# Altium project 220V to 48v SMPS.PrjPcb
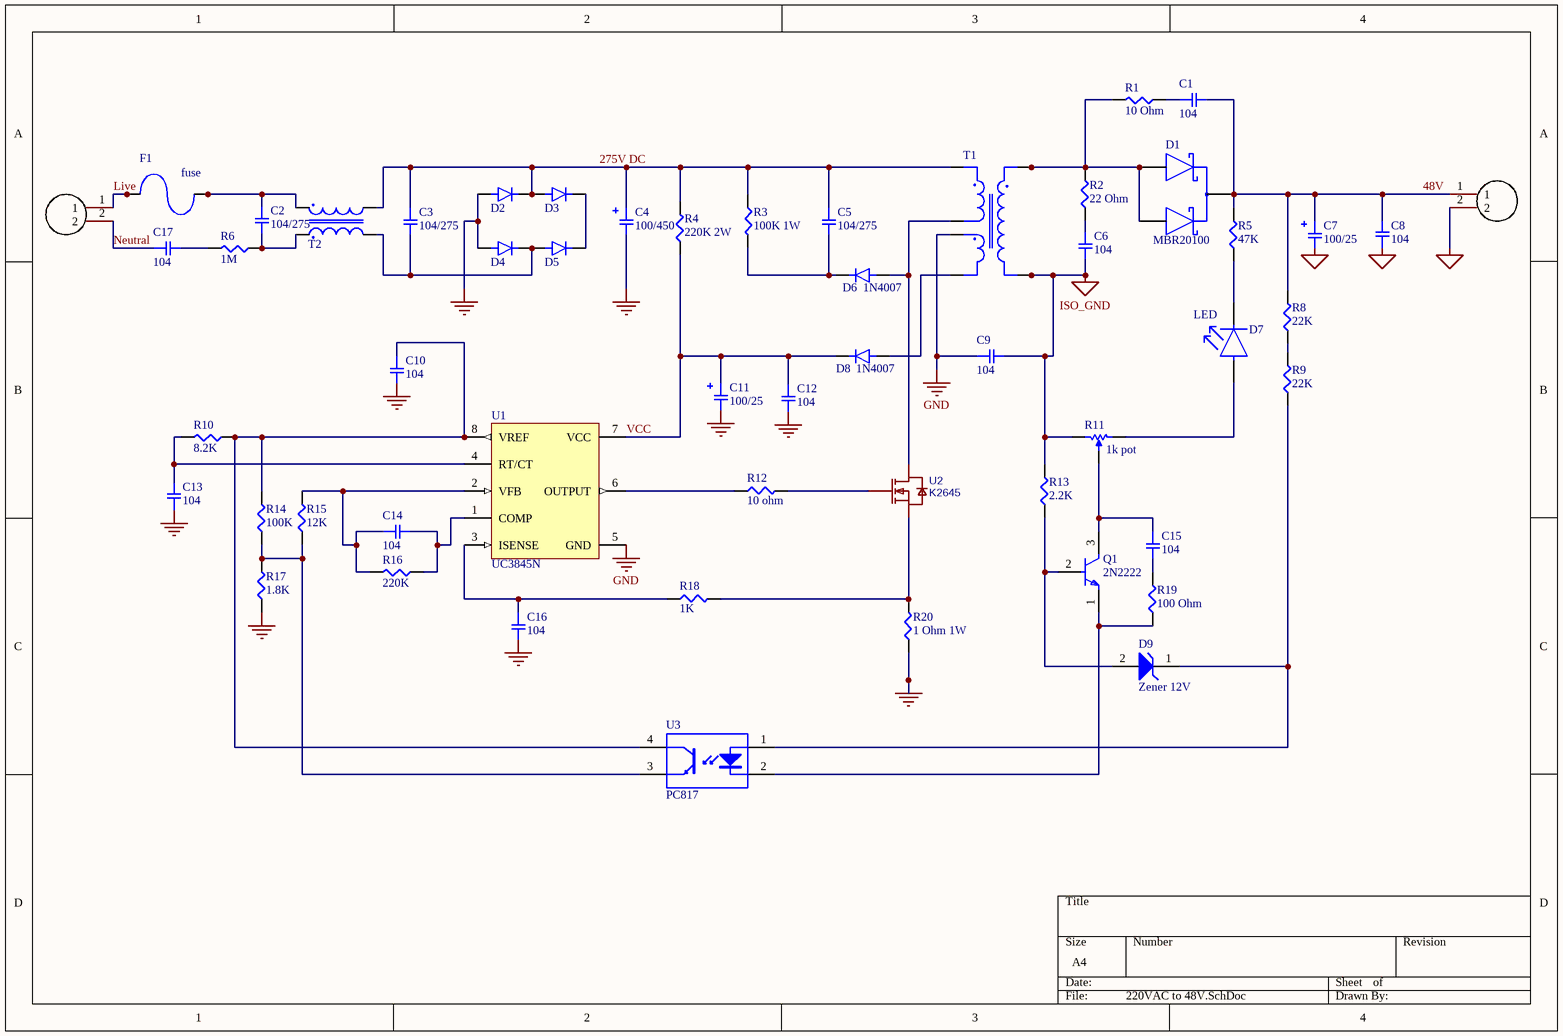
[diagram p0: 220VAC to 48V.SchDoc]
1 sheet, 54 parts. Net scope: global (net labels, ports and power ports of the same name join across sheets).
Board file: 220VAC to 48V.PcbDoc

## Sheet 220VAC to 48V.SchDoc
size A4; SheetNumber: 1; SheetTotal: 1

### Parts
C1  104  [C-1]
C2  104/275  [C-15]
C3  104/275  [C-15]
C4  100/450  [C5B2.5]
C5  104/275  [C-15]
C6  104  [C-1]
C7  100/25  [C2.5-2]
C8  104  [C-1]
C9  104  [C-1]
C10  104  [C-1]
C11  100/25  [C2.5-2]
C12  104  [C-1]
C13  104  [C-1]
C14  104  [C-1]
C15  104  [C-1]
C16  104  [C-1]
C17  104  [C-1]
CN1  WJ2EDGRC-5.08-2P  [Terminal Block P5.08-2P]  (value not drawn)
CN2  WJ2EDGRC-5.08-2P  [Terminal Block P5.08-2P]  (value not drawn)
D1  MBR20100  [FP-MBR20100CT-E3-4W-MFG]
D2  1N4007  [FP-1N4007-MFG]  (value not drawn)
D3  1N4007  [FP-1N4007-MFG]  (value not drawn)
D4  1N4007  [FP-1N4007-MFG]  (value not drawn)
D5  1N4007  [FP-1N4007-MFG]  (value not drawn)
D6  1N4007  [FP-1N4007-MFG]
D7  LED  [FP-HLMP-1719-MFG]
D8  1N4007  [FP-1N4007-MFG]
D9  Zener 12V  [ONSC-SURMETIC40-2-017AA-01]
F1  fuse  [SHK20L]
Q1  2N2222  [FP-JAN2N2222A-MFG]
R1  10 Ohm  [R7-5]
R2  22 Ohm  [R7-5]
R3  100K 1W  [R-12,5]
R4  220K 2W  [R-12,5]
R5  47K  [R7-5]
R6  1M  [R7-5]
R8  22K  [R7-5]
R9  22K  [R7-5]
R10  8.2K  [R7-5]
R11  1k pot  [BOUR-3296W-1-3]
R12  10 ohm  [R7-5]
R13  2.2K  [R7-5]
R14  100K  [R7-5]
R15  12K  [R7-5]
R16  220K  [R7-5]
R17  1.8K  [R7-5]
R18  1K  [R7-5]
R19  100 Ohm  [R7-5]
R20  1 Ohm 1W  [R-12,5]
T1  Ideal Transformer With Central Tap  [ST-D1]  (value not drawn)
T2  common mode choke  [DFKH14]  (value not drawn)
U1  UC3845N  [P0008A]
U2  K2645  [TO-220-3_L10.5-W4.8-P2.54-L]
U3  PC817  [LTST-LTV-817-4]

### Nets
GND: C4.2 C9.1 C10.2 C11.2 C12.2 C13.1 C16.2 D2.2(A) D4.2(A) R17.1 R20.1 T1.8 U1.5(GND)
ISO_GND: C6.2 C7.2 C8.1 C9.2 CN1.2 R11.3(B) R13.2 T1.1 T1.2
48V: C1.2 C7.1 C8.2 CN1.1 D1.2(COMMON_CATHODE) R5.2 R8.2
275V DC: C3.1 C4.1 C5.1 D2.1(C) D3.2(A) R3.1 R4.2 T1.7 T2.3
Live: CN2.1 F1.1A F1.1B
Neutral: C17.1 CN2.2
VCC: C11.1 C12.1 D8.1(C) R4.1 U1.7(VCC)
NetC1_1: C1.1 R1.1
NetC2_1: C2.1 F1.2A F1.2B T2.4
NetC2_2: C2.2 R6.1 T2.1
NetC3_2: C3.2 D4.1(C) D5.2(A) T2.2
NetC5_2: C5.2 D6.1(C) R3.2
NetC6_1: C6.1 R2.1
NetC10_1: C10.1 R10.1 R14.2 U1.8(VREF) U3.4(COLLECTOR)
NetC13_2: C13.2 R10.2 U1.4(RT/CT)
NetC14_1: C14.1 R15.2 R16.2 U1.2(VFB)
NetC14_2: C14.2 R16.1 U1.1(COMP)
NetC15_1: C15.1 Q1.3(C) R11.2(TAP)
NetC15_2: C15.2 R19.2
NetC16_1: C16.1 R18.1 U1.3(ISENSE)
NetC17_2: C17.2 R6.2
NetD1_1: D1.1(1_ANODE) D1.3(2_ANODE) R1.2 R2.2 T1.5 T1.6
NetD3_1: D3.1(C) D5.1(C)
NetD6_2: D6.2(A) T1.9 U2.2(D)
NetD7_1: D7.1(C) R5.1
NetD7_2: D7.2(A) R11.1(A)
NetD8_2: D8.2(A) T1.12
NetD9_1: D9.1(K) R9.1 U3.1(ANODE)
NetD9_2: D9.2(A) Q1.2(B) R13.1
NetQ1_1: Q1.1(E) R19.1 U3.2(CATHODE)
NetR8_1: R8.1 R9.2
NetR12_1: R12.1 U1.6(OUTPUT)
NetR12_2: R12.2 U2.1(G)
NetR14_1: R14.1 R15.1 R17.2 U3.3(EMITTER)
NetR18_2: R18.2 R20.2 U2.3(S)

### Library data of the parts
C1 C6 C8-C10 C12-C17 = CAPACITOR 104
C2 C3 C5 = CAPACITOR 104/275
C4 = CAPACITOR 100/450
C7 C11 = CAPACITOR 100/25
CN1 CN2 = WJ2EDGRC-5.08-2P: Manufacturer: KANGNEX(康奈克斯电气); Add into BOM: yes; Connector Type: 板端/Receptacle-Close; Structure: 1x2P; Pitch: 5.08mm; Number of PINs Per Row: 2; Symbol: WJ2EDGRC-5.08-2P; Device: WJ2EDGRC-5.08-2P; Supplier: LCSC; Manufacturer Part: WJ2EDGRC-5.08-2P; Supplier Part: C3697; JLCPCB Part Class: Extended Part; LCSC Part Name: 5.08mm 1x2P 排数:1 每排P数:2; Supplier Footprint: 弯插,P=5.08mm; Datasheet: https://atta.szlcsc.com/upload/public/pdf/source/20191225/C3697_6E7B45CD3FD3DA2CDF6A2CE707235E10.pdf; Convert to PCB: yes; Color: Green; Mounting Style: Bend; Number of Pins: 2P; Number of Rows: 1
D1 = CMP-00030-42878425-1: MBR20100CT-E3/4W Dual Common-Cathode High-Voltage Schottky Rectifier | DIODE ARRAY SCHOTTKY 100V TO220; Forward Voltage: 800mV; Max Junction Temperature (Tj): 150°C; Forward Current: 20A; Max Surge Current: 150A; Max Reverse Leakage Current: 100µA; Average Rectified Current: 10A; Element Configuration: Common Cathode; Length: 10.5156mm; Schedule B: 8541100080, 8541100080|8541100080, 8541100080|8541100080|8541100080, 8541100080|8541100080|8541100080|8541100080; Case/Package: TO-220AB; Max Reverse Voltage (DC): 100V; NexarPartId: 42878425; Number of Pins: 3; Min Operating Temperature: -65°C; Reverse Voltage: 100V; Height: 15.3162mm; Peak Non-Repetitive Surge Current: 150A; RoHS: Compliant; Max Operating Temperature: 150°C; Radiation Hardening: No; Lead Free: Lead Free; Mount: Through Hole; Max Repetitive Reverse Voltage (Vrrm): 100V; Max Forward Surge Current (Ifsm): 150A; Width: 4.699mm; Peak Reverse Current: 100µA
D2-D6 D8 = CMP-02540-000046-1: DIODE GEN PURP 1KV 1A DO204AL; Manufacturer: Vishay; Manufacturer Part Number: 1N4007-E3/54; Value: 15pF; Max Junction Temp: +150°C; Max Surge Forward Current: 30A; Max Repetitive Reverse Voltage: 1000V; Peak Reverse Current: 30uA; Octopart: https://octopart.com/1n4007-e3%2F54-vishay-39548207; Digikey Description: DIODE GEN PURP 1KV 1A DO204AL; Category: Diode; Mouser Description: Rectifiers Vr/1000V Io/1A; Automotive: No; Package: 1N4007; Device Class L3: Rectifier Diodes; Temperature Range High: +150°C; Capacitance: 15pF; Ipc Land Pattern Name: DIOPA1088W105L520D270; Lead Free: Yes; ComponentLink2Description: Datasheet; Forward Current: 1A; Device Class L1: Discrete Semiconductors; ComponentLink2URL: http://www.vishay.com/docs/88503/1n4001.pdf; Temperature Range Low: -50°C; Height: 2.7mm; RoHS: TRUE; Temperature: -50°C to +150°C; Device Class L2: Diodes
D7 = CMP-2000-06410-2: IR LED SFH480; Manufacturer: Broadcom; Wavelength: 880nm; Led Orientation: Straight; Luminous Intensity: 2.1mcd; Forward Voltage: 1.8V; Viewing Angle: 50°; Colour: Yellow; Reverse Voltage: 5V; Power Dissipation: 17.5mW; Forward Current: 2mA; Lead Free: Yes; Automotive: No; Device Class L1: Optoelectronics; Mouser Description: Standard LEDs - Through Hole Yellow Diffused 585nm 2.1mcd; Digikey Description: LED YELLOW DIFFUSED T-1 T/H; Temperature: -40°C to +100°C; Temperature Range High: +100°C; Package: 0; Category: Diode; Device Class L2: LEDs; ComponentLink2Description: Datasheet; ComponentLink2URL: https://docs.broadcom.com/docs/AV02-1557EN; Temperature Range Low: -40°C; Device Class L3: unset; Octopart: https://octopart.com/hlmp-1719-broadcom-71130405; RoHS: TRUE; Manufacturer Part Number: HLMP-1719
D9 = 1N4742A-TR: Diode, Zener, Vr 12V, If 200mA, Pkg DO-41, Vf 1.2V, Tj +175C, Cs 380mA, Pd 1.3W, Ir 21mA; Manufacturer: Vishay; Tolerance: 5%; Impedance: 9R; Max Reverse Leakage Current: 5uA; Supplier: Digikey; Supplier Part Number: 1N4742AVSCT-ND; Manufacturer Part Number: 1N4742A-TR; RoHS: Yes; Category: Zener Diodes; Stock: 55025; Pricing: 1=0.36, 10=0.251, 100=0.1267, 500=0.10332, 1000=0.07666, 2000=0.0645 (USD); Mounting Technology: Through Hole; Case/Package: DO-41; Pins: 2; Min Operating Temperature: -65°C; Max Operating Temperature: 175°C; Packaging: Cut Tape; Zener Voltage: 12V; Power Dissipation: 1.3W; Max Power Dissipation: 1.3W; Test Current: 21mA; Voltage Tolerance: 5%; Series: Automotive, AEC-Q101; Forward Voltage: 1.2V; Working Voltage: 12V; Max Reverse Current: 5uA; Breakdown Voltage: 12V; Diameter: 2.6mm; Length: 0.161inch; Width: 2.6mm; Height: 2.6mm; Radiation Hardening: No; Lead Free: Lead Free; RoHS Compliant: Yes; Reach SVHC Compliant: Unknown; ComponentLink1URL: https://datasheet.ciiva.com/27050/813394-27050166.pdf?src-supplier=Jameco; ComponentLink1Description: https://datasheet.ciiva.com/27050/813394-27050166.pdf?src-supplier=Jameco; ComponentLink2URL: https://datasheet.ciiva.com/18434/70061602-18434087.pdf?src-supplier=Allied+Electronics; ComponentLink2Description: https://datasheet.ciiva.com/18434/70061602-18434087.pdf?src-supplier=Allied+Electronics; ComponentLink3URL: https://datasheet.ciiva.com/26320/1n4728a-26320207.pdf?src-supplier=Element14; ComponentLink3Description: https://datasheet.ciiva.com/26320/1n4728a-26320207.pdf?src-supplier=Element14
Q1 = CMP-06366-000013-1: TRANS NPN 50V 0.8A TO218
R1 R2 R5 R6 R8-R10 R12-R19 = RESISTOR 1/4W
R3 R4 R20 = RESISTOR 2W
R11 = CMP-1747-00002-1: Square Trimpot(R) Trimming Potentiometer, 1000 Ohm, -55 to 125 degC, 3-Pin THD, RoHS, Tube; Case\Package: 0603; Tolerance: 1%; Power Rating: 100 mW; Voltage Rating: 75 V; Resistance: 4.7 kohm; ComponentLink2URL: http://www.bourns.com/docs/Product-Datasheets/3296.pdf; Packaging: Tape and Reel; REACH SVHC: Yes; ComponentLink1URL: http://www.bourns.com/; Case Code (Metric): 1608; Width: 0.8 mm; ComponentLink1Description: Manufacturer URL; DatasheetVersion: May-16; Max Operating Temperature: 155 degC; PackageReference: 3296W-1-3; PackageDescription: 3-Pin Through Hole Device, Body 9.53 x 4.83 mm, Pitch 2.54 mm; Weight: 7.1E-05 oz; ComponentLink2Description: Datasheet; RoHSCompliant: true; Min Operating Temperature: -55 degC; Radiation Hardening: No; Case Code (Imperial): 0603; Length: 1.6 mm; Package Quantity: 5000; Pins: 2; Mount: Surface Mount; Height: 0.45 mm
T1 = Transformer With Central Tap Ideal_1: SimulationGenericComponent: True
T2 = Transformer With Central Tap Ideal: SimulationGenericComponent: True
U1 = CMP-0319-00305-2: PWM Controller with Current Control, 50 % Duty Cycle, 0 to +70 degC, 8-pin PDIP (P), Green (RoHS & no Sb/Br); Manufacturer: Texas Instruments; Rating: Catalog; UVLO Thresholds On/Off(V): 8.4/7.6; Regulated Outputs(#): 1; Duty Cycle(Max)(%): 50; Frequency(Max)(kHz): 450; Topology: Boost, Buck, Flyback, Forward; PackageReference: P0008A; PackageDescription: 8-Pin Plastic Dual-In-Line Package, Row Spacing 7.62 mm, Pitch 2.54 mm; SubFamily: PWM Controller; ComponentLink1URL: http://www.ti.com/general/docs/lit/getliterature.tsp?genericPartNumber=UC3845&fileType=pdf; PartNumber: UC3845N; ComponentLink1Description: Datasheet; Control Method: Current; DatasheetVersion: SLUS223C; Eco-Plan: Green (RoHS & no Sb/Br); PackageVersion: revE, Apr-2010; Mounting Technology: Through Hole; Code_JEDEC: MS-001-BA
U2 = 2SK2645-01MR-VB: Manufacturer: VBsemi(微碧半导体); Contributor: lcsc; Supplier: LCSC; Supplier Part: C19190251; Manufacturer Part: 2SK2645-01MR-VB; spicePre: U; spiceSymbolName: 2SK2645-01MR-VB
U3 = CMP-2000-06632-1: Photocoupuler, 50 mA Forward Current, 1.2 V Forward Voltage, -50 to 110 degC, 4-Pin DIP, RoHS, Tube; Manufacturer: Lite-On; Maximum Fall Time: 18us; Maximum Collector Emitter Saturation Voltage: 200mV; Maximum Forward Voltage: 1.4V; Typical Rise Time: 4us; Maximum Collector Current: 50mA; Maximum Collector Emitter Voltage: 35V; Product Length: 4.6mm; Maximum Reverse Voltage: 6V; Minimum Isolation Voltage: 5000Vrms; Number of Channels per Chip: 1; Typical Fall Time: 3us; Product Width: 6.5mm; Minimum Current Transfer Ratio: 50%; Output Type: DC; Output Device: Transistor; Maximum Current Transfer Ratio: 600%; Pin_Count: 4; Product Height: 3.5mm; Maximum Power Dissipation: 200mW; Typical Forward Voltage: 1.2V; Package Reference: LTV-817; Datasheet URL: http://optoelectronics.liteon.com/upload/download/DS70-2012-0050/S_110_LTV-8X7%20series%200915.pdf; Family: LTV817; Package Description: 4-Pin Double In-line Package, Body 6.5 x 4.6 mm, Pitch 2.54 mm; Maximum Rise Time: 18us; Product Type: TransistorandPhotovoltaicOutputPhotoCouplers; Supplier_Package: PDIP; Mounting: ThroughHole; Minimum Operating Temperature: -30C; Manufacturer URL: http://www.us.liteon.com/; Datasheet Version: Rev. E, 10/2015; Mounting Technology: ThroughHole; Maximum Operating Temperature: 100C; Input Type: DC; Maximum Input Current: 50mA